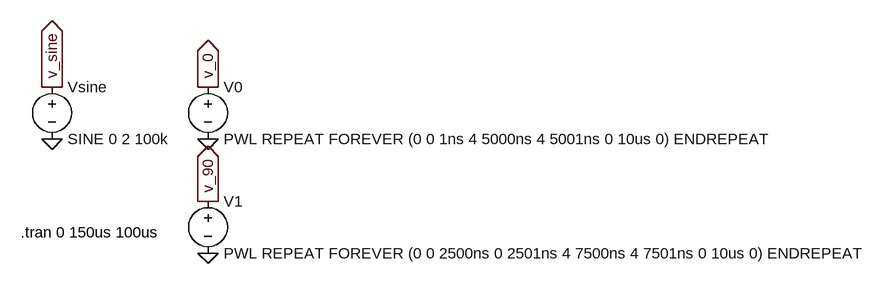
[diagram p0: schematic ideal_oscillator.asc]
ideal_oscillator.asc, the LTspice schematic file:
Version 4
SHEET 1 1492 680
FLAG 256 336 0
FLAG 256 256 v_sine
IOPIN 256 256 Out
FLAG 496 336 0
FLAG 496 256 v_0
IOPIN 496 256 Out
FLAG 496 512 0
FLAG 496 432 v_90
IOPIN 496 432 Out
SYMBOL voltage 256 240 R0
SYMATTR InstName Vsine
SYMATTR Value SINE 0 2 100k
SYMBOL voltage 496 240 R0
SYMATTR InstName V0
SYMATTR Value PWL REPEAT FOREVER (0 0 1ns 4 5000ns 4 5001ns 0 10us 0) ENDREPEAT
SYMBOL voltage 496 416 R0
SYMATTR InstName V1
SYMATTR Value PWL REPEAT FOREVER (0 0 2500ns 0 2501ns 4 7500ns 4 7501ns 0 10us 0) ENDREPEAT
TEXT 208 480 Left 2 !.tran 0 150us 100us

The netlist it stands for:
* ideal_oscillator.asc
Vsine v_sine 0 SINE 0 2 100k
V0 v_0 0 PWL REPEAT FOREVER (0 0 1ns 4 5000ns 4 5001ns 0 10us 0) ENDREPEAT
V1 v_90 0 PWL REPEAT FOREVER (0 0 2500ns 0 2501ns 4 7500ns 4 7501ns 0 10us 0) ENDREPEAT
.tran 0 150us 100us
.backanno
.end